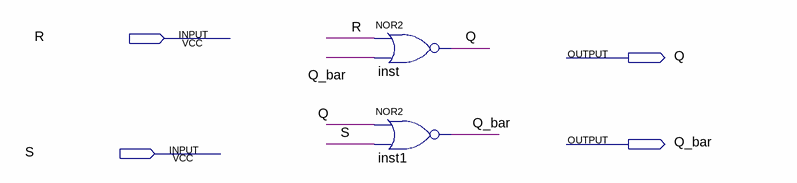
[diagram p0: schematic sheet]
// Quartus schematic RS_Latch_NOR.bdf as structural Verilog: 2 symbols, 4 pins
module RS_Latch_NOR (
  input  R,
  input  S,
  output Q,
  output Q_bar
);

  nor inst (Q, R, Q_bar);
  nor inst1 (Q_bar, Q, S);
endmodule
